# EAGLE board EM80RD (EAGLE 7.4.0), part 1 of 2
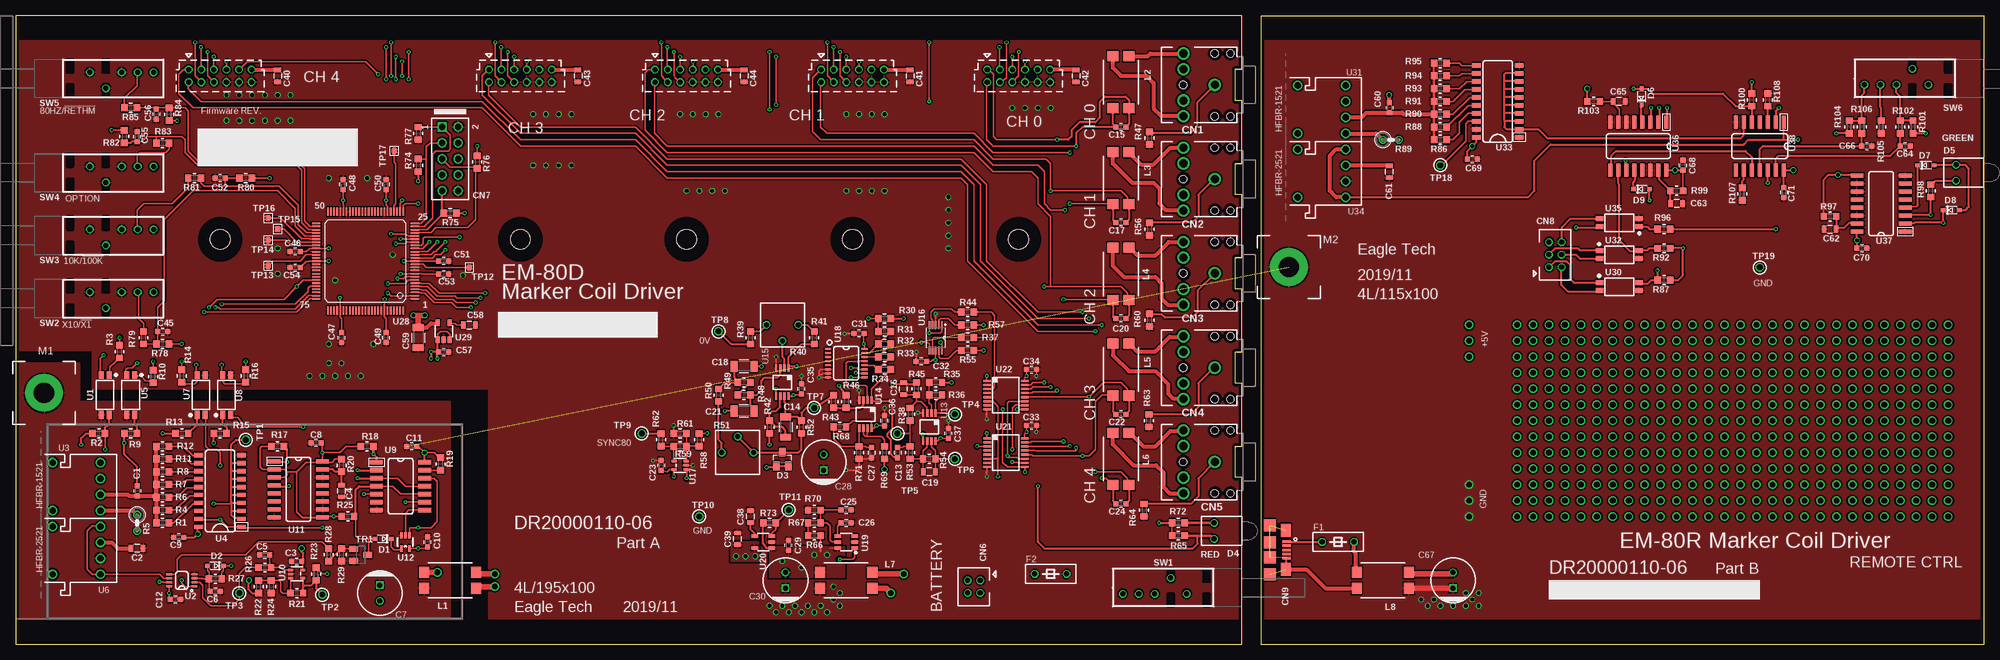
[diagram p6: board, top side]
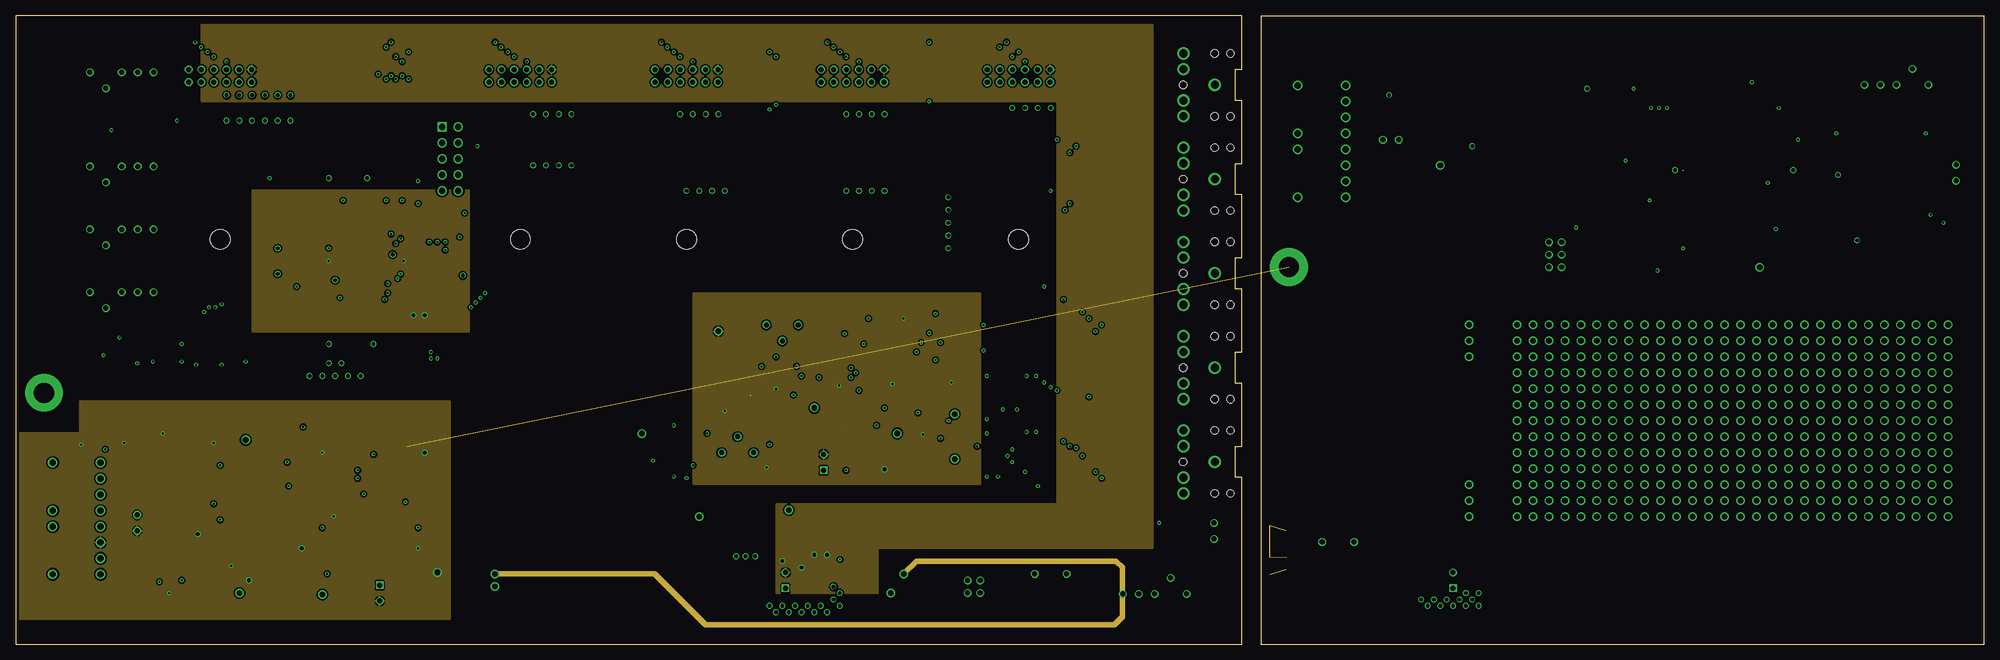
[diagram p7: board, inner layer Route2]
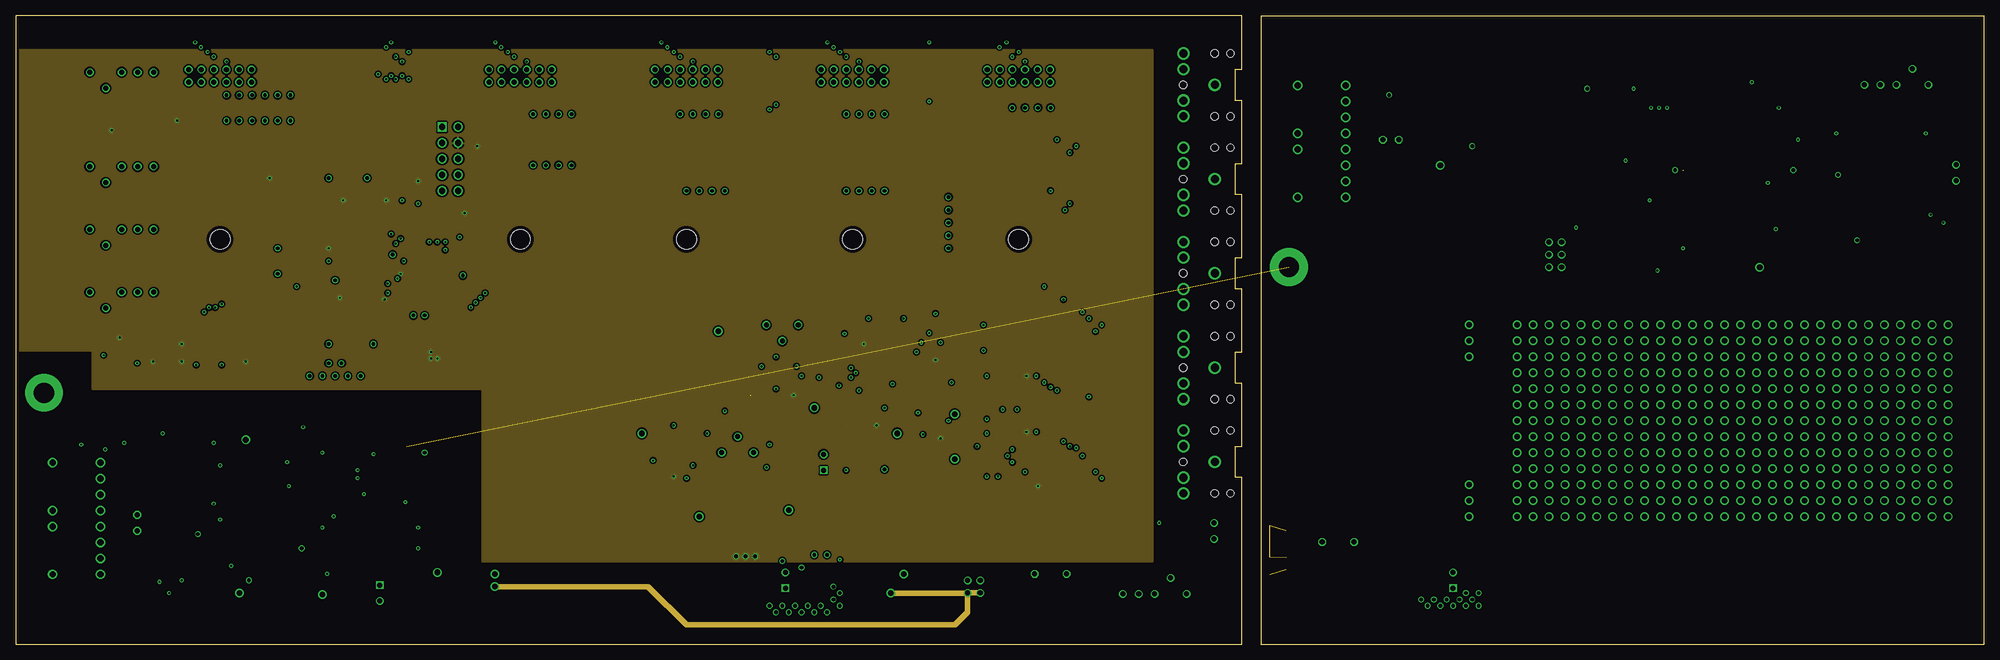
[diagram p8: board, inner layer Route15]
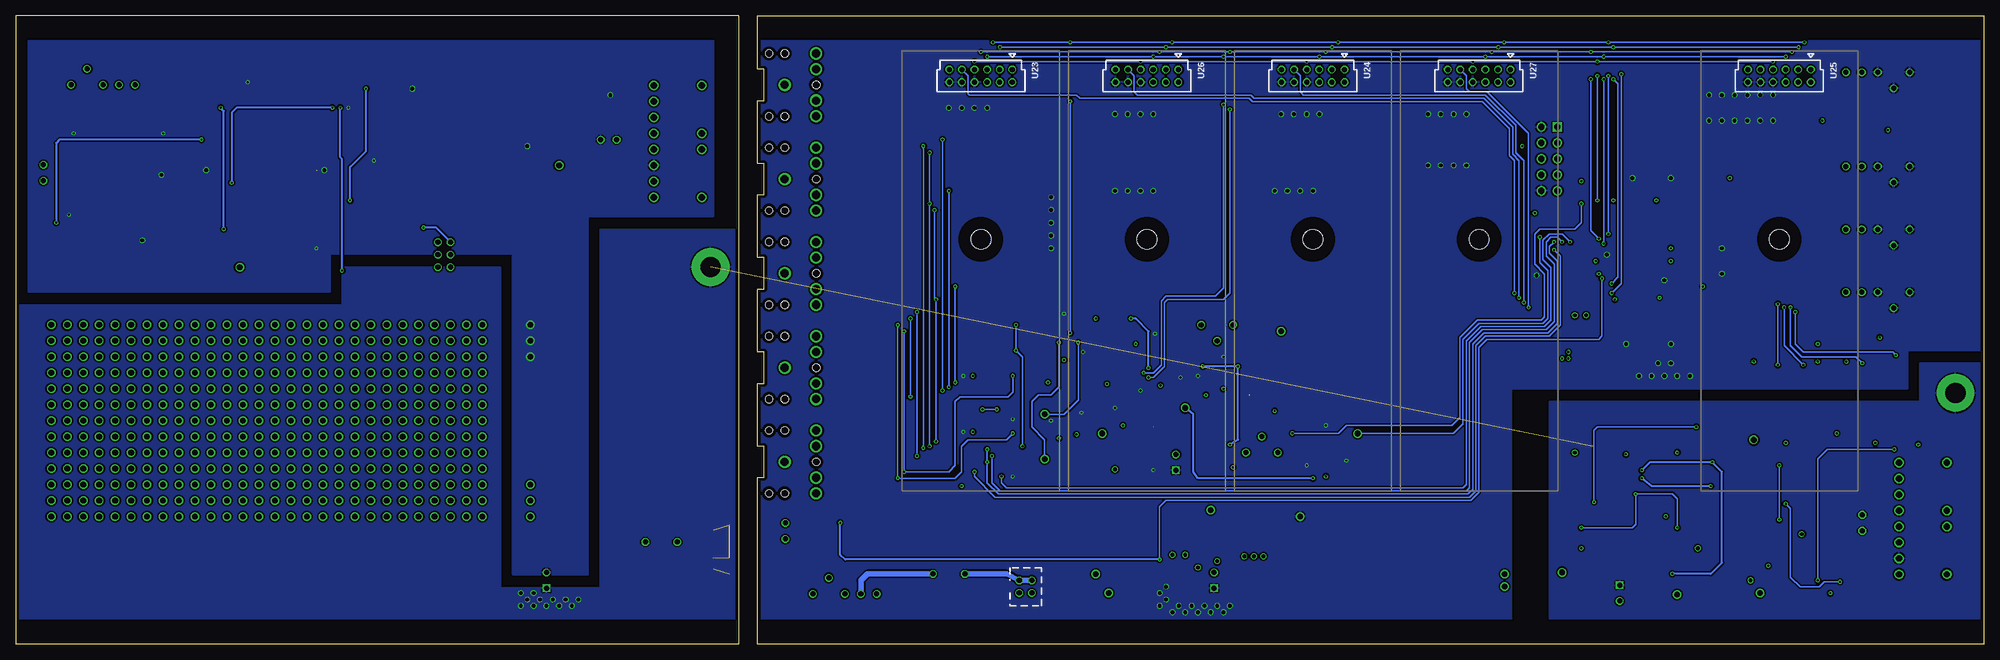
[diagram p9: board, bottom side, seen from below]

Size 313 x 100 mm. Coordinates in mm from the lower left corner, seen from the top.
Outline: 0,0 195,0 195,26.5 194,26.5 194,31.5 195,31.5 195,41.5 194,41.5 194,46.5 195,46.5 195,56.5 194,56.5 194,61.5 195,61.5 195,71.5 194,71.5 194,76.5 195,76.5 195,86.5 194,86.5 194,91.5 195,91.5 195,100 0,100 0,0
Outline: 198,0 313,0 313,100 198,100 198,0
Copper layers (1+2*15+16): Top 0.018mm / dielectric 0.25mm / Route2 0.035mm / dielectric 1mm / Route15 0.035mm / dielectric 0.25mm / Bottom 0.018mm
Design rules "pban_5mil-l4 *": minimum track width 5mil, minimum drill 0.3mm, track to track 5mil, track to pad 0.229mm, pad to pad 5mil, via to via 5mil, smd to smd 5mil, copper to edge 0.5mm, drill to drill 0.5mm, minimum pad ring 0.15mm, minimum via ring 0.15mm, stop-mask expansion 0.05mm, vias tented up to drill 0.35mm, thermal gap 10mil
tRestrict: area 0,0 to 195,3; area 0,97 to 195,100; area 198,0 to 313,3; area 198,97 to 313,100
bRestrict: area 198,97 to 313,100; area 198,0 to 313,3

## Footprints (pad centres in the part's own frame; a part is rotated, then mirrored left to right if it is on the bottom)
CM1608 = smd 0.8 x 0.8: 1 -0.8,0; 2 0.8,0
CM2012 = smd 0.7 x 1.1: 1 -0.95,0; 2 0.95,0
PHI_6.3 = drill 0.8 square: NEG 0,-1.25 | drill 0.8: POS 0,1.25
CM3216 = smd 1.1 x 1.8: 1 -1.6,0; 2 1.6,0
35RAPC2BHN2 = drill 1.3: 1 4.3,0; 2 9.3,-5; 3 9.3,5; 10 9.3,-2.5; 11 9.3,2.5 | hole 1.2: 4.3,5; 9.3,0; 1.8,-5; 4.3,-5; 1.8,5
DF11-4DP-2DSA = drill 0.8: 1 1,-1; 2 1,1; 3 -1,-1; 4 -1,1
PIN_HEADER_10PIN = drill 1 square: 1 -5.08,-1.27 | drill 1: 2 -5.08,1.27; 3 -2.54,-1.27; 4 -2.54,1.27; 5 0,-1.27; 6 0,1.27; 7 2.54,-1.27; 8 2.54,1.27; 9 5.08,-1.27; 10 5.08,1.27
DF11-6DP-2DSA = drill 0.8: 1 2,-1; 2 2,1; 3 0,-1; 4 0,1; 5 -2,-1; 6 -2,1
ZX62-B-5PA = smd 0.4 x 1.35: 1 -1.3,2.675; 2 -0.65,2.675; 3 0,2.675; 4 0.65,2.675; 5 1.3,2.675 | smd 1.9 x 1.9: C1 3.9,0; C2 1.2,0; C3 -1.2,0; C4 -3.9,0 | smd 2.1 x 1.6: C5 3.1,2.55; C6 -3.1,2.55
SOD323-R = smd 0.8 x 0.6: A 1.25,0; C -1.25,0
SOT23 = smd 1 x 1.4: 1 -0.95,-1.1; 2 0.95,-1.1; 3 0,1.1
L-93A8CB = drill 0.8: A 1.27,0; C -1.27,0
8X3/5.08 = drill 0.813 octagon: 1 -2.54,0; 2 2.54,0
ZJYS51-2 = smd 1.8 x 1.6: 1 -1.27,-4.15; 2 1.27,-4.15; 3 1.27,4.15; 4 -1.27,4.15
VAB_3_10_CONTACT = drill 3.2 pad 6: CASE1 0,0
RM1608 = smd 1 x 1.1: 1 -1,0; 2 1,0
0207/2V = drill 0.813 octagon: 1 -1.27,0; 2 1.27,0
CT-6 = drill 0.8: 1 -2.54,0; 2 0,2.54; 3 2.54,0
A-12* = drill 0.8: 1 2.54,1; 2 0,1; 3 -2.54,1; 7 -7.62,1; 8 -5.08,-1.54
TP_TH_0R9MM = drill 0.9: 1 0,0
TP_PAD_1MM = smd 1 x 1: P$1 0,0
SOT23-BEC = smd 1 x 1.4: B -0.95,-1.1; C 0,1.1; E 0.95,-1.1
SO4(11-3C1)(TOSHIBA) = smd 0.8 x 1.2: 1 -0.635,-3.15; 2 0.635,-3.15; 3 0.635,3.15; 4 -0.635,3.15
SSOP8-P-065 = smd 0.34 x 0.9: 1 -0.975,-2; 2 -0.325,-2; 3 0.352,-2; 4 0.975,-2; 5 0.975,2; 6 0.325,2; 7 -0.325,2; 8 -0.975,2
HFBR-X52X = drill 1: 1 0,3.81; 2 0,1.27; 3 0,-1.27; 4 0,-3.81; 5 7.62,-3.81; 8 7.62,3.81
SO20_300MIL = smd 0.7 x 1.4: 1 -5.715,-3.4; 2 -4.445,-3.4; 3 -3.175,-3.4; 4 -1.905,-3.4; 5 -0.635,-3.4; 6 0.635,-3.4; 7 1.905,-3.4; 8 3.175,-3.4; 9 4.445,-3.4; 10 5.715,-3.4; 11 5.715,3.4; 12 4.445,3.4; 13 3.175,3.4; 14 1.905,3.4; 15 0.635,3.4; 16 -0.635,3.4; 17 -1.905,3.4; 18 -3.175,3.4; 19 -4.445,3.4; 20 -5.715,3.4
SO14_300MIL = smd 0.66 x 2.032: 1 -3.81,-3.835; 2 -2.54,-3.835; 3 -1.27,-3.835; 4 0,-3.835; 5 1.27,-3.835; 6 2.54,-3.835; 7 3.81,-3.835; 8 3.81,3.835; 9 2.54,3.835; 10 1.27,3.835; 11 0,3.835; 12 -1.27,3.835; 13 -2.54,3.835; 14 -3.81,3.835
SC88A = smd 0.4 x 0.8: 1 -0.65,-0.95; 2 0,-0.95; 3 0.65,-0.95; 4 0.65,0.95; 5 -0.65,0.95
SO16_300MIL = smd 0.66 x 2.032: 1 -4.445,-3.835; 2 -3.175,-3.835; 3 -1.905,-3.835; 4 -0.635,-3.835; 5 0.635,-3.835; 6 1.905,-3.835; 7 3.175,-3.835; 8 4.445,-3.835; 9 4.445,3.835; 10 3.175,3.835; 11 1.905,3.835; 12 0.635,3.835; 13 -0.635,3.835; 14 -1.905,3.835; 15 -3.175,3.835; 16 -4.445,3.835
SSOP5-P-065A(USV) = smd 0.4 x 1: 1 -0.65,-1.05; 2 0,-1.05; 3 0.65,-1.05; 4 0.65,1.05; 5 -0.62,1.05
MSO8_AEL = smd 0.34 x 1.19: 1 -0.975,-2.23; 2 -0.325,-2.23; 3 0.325,-2.23; 4 0.975,-2.23; 5 0.975,2.23; 6 0.325,2.23; 7 -0.325,2.23; 8 -0.975,2.23
MSOP10 = smd 1.27 x 0.279: 1 -2.032,0.991; 2 -2.032,0.508; 3 -2.032,0; 4 -2.032,-0.508; 5 -2.032,-0.991; 6 2.032,-0.991; 7 2.032,-0.508; 8 2.032,0; 9 2.032,0.508; 10 2.032,0.991
TSSOP16-P-044-065A = smd 0.29 x 1: 1 -2.275,-2.9; 2 -1.625,-2.9; 3 -0.975,-2.9; 4 -0.325,-2.9; 5 0.325,-2.9; 6 0.975,-2.9; 7 1.625,-2.9; 8 2.275,-2.9; 9 2.275,2.9; 10 1.625,2.9; 11 0.975,2.9; 12 0.325,2.9; 13 -0.325,2.9; 14 -0.975,2.9; 15 -1.625,2.9; 16 -2.275,2.9
SOT-23 = smd 0.6 x 1.05: 1 -0.95,-1.35; 2 0,-1.35; 3 0.95,-1.35; 4 0.95,1.35; 5 0,1.35; 6 -0.95,1.35
SOT-23-5 = smd 0.6 x 1.05: 1 -0.95,-1.35; 2 0,-1.35; 3 0.95,-1.35; 4 0.95,1.35; 5 -0.95,1.35
TSSOP16_AEL = smd 0.34 x 1.19: 1 -2.275,-2.97; 2 -1.625,-2.97; 3 -0.975,-2.97; 4 -0.325,-2.97; 5 0.325,-2.97; 6 0.975,-2.97; 7 1.625,-2.97; 8 2.275,-2.97; 9 2.275,2.97; 10 1.625,2.97; 11 0.975,2.97; 12 0.325,2.97; 13 -0.325,2.97; 14 -0.975,2.97; 15 -1.625,2.97; 16 -2.275,2.97
DR20000114 = drill 0.8: 1 1,-5; 2 -1,-5; 3 1,-3; 4 -1,-3; 5 1,-1; 6 -1,-1; 7 1,1; 8 -1,1; 9 1,3; 10 -1,3; 11 1,5; 12 -1,5 | hole 3.2: -26,0
QFP100_0.5 = smd 1.3 x 0.25: 1 -7.85,6; 2 -7.85,5.5; 3 -7.85,5; 4 -7.85,4.5; 5 -7.85,4; 6 -7.85,3.5; 7 -7.85,3; 8 -7.85,2.5; 9 -7.85,2; 10 -7.85,1.5; 11 -7.85,1; 12 -7.85,0.5; 13 -7.85,0; 14 -7.85,-0.5; 15 -7.85,-1; 16 -7.85,-1.5; 17 -7.85,-2; 18 -7.85,-2.5; 19 -7.85,-3; 20 -7.85,-3.5; 21 -7.85,-4; 22 -7.85,-4.5; 23 -7.85,-5; 24 -7.85,-5.5; 25 -7.85,-6; 51 7.85,-6; 52 7.85,-5.5; 53 7.85,-5; 54 7.85,-4.5; 55 7.85,-4; 56 7.85,-3.5; 57 7.85,-3; 58 7.85,-2.5; 59 7.85,-2; 60 7.85,-1.5; 61 7.85,-1; 62 7.85,-0.5; 63 7.85,0; 64 7.85,0.5; 65 7.85,1; 66 7.85,1.5; 67 7.85,2; 68 7.85,2.5; 69 7.85,3; 70 7.85,3.5; 71 7.85,4; 72 7.85,4.5; 73 7.85,5; 74 7.85,5.5; 75 7.85,6 | smd 0.25 x 1.3: 26 -6,-7.85; 27 -5.5,-7.85; 28 -5,-7.85; 29 -4.5,-7.85; 30 -4,-7.85; 31 -3.5,-7.85; 32 -3,-7.85; 33 -2.5,-7.85; 34 -2,-7.85; 35 -1.5,-7.85; 36 -1,-7.85; 37 -0.5,-7.85; 38 0,-7.85; 39 0.5,-7.85; 40 1,-7.85; 41 1.5,-7.85; 42 2,-7.85; 43 2.5,-7.85; 44 3,-7.85; 45 3.5,-7.85; 46 4,-7.85; 47 4.5,-7.85; 48 5,-7.85; 49 5.5,-7.85; 50 6,-7.85; 76 6,7.85; 77 5.5,7.85; 78 5,7.85; 79 4.5,7.85; 80 4,7.85; 81 3.5,7.85; 82 3,7.85; 83 2.5,7.85; 84 2,7.85; 85 1.5,7.85; 86 1,7.85; 87 0.5,7.85; 88 0,7.85; 89 -0.5,7.85; 90 -1,7.85; 91 -1.5,7.85; 92 -2,7.85; 93 -2.5,7.85; 94 -3,7.85; 95 -3.5,7.85; 96 -4,7.85; 97 -4.5,7.85; 98 -5,7.85; 99 -5.5,7.85; 100 -6,7.85

## Placement (x,y rotation side)
C1  680p  [CM1608]  19.3,24.38 270 top
C2  1u/25V  [CM2012]  19.3,15.24 180 top
C3  0.1u/16V  [CM1608]  44.7,13.21 0 top
C4  1u/16V  [CM2012]  51.82,24.38 90 top
C5  0.1u/16V  [CM1608]  39.62,14.22 0 top
C6  1u/25V  [CM1608]  31.75,8.38 0 top
C7  56u/10V/OS  [PHI_6.3]  57.91,8.13 180 top
C8  0.1u/16V  [CM1608]  47.75,32 180 top
C9  0.1u/16V  [CM1608]  25.91,17.02 180 top
C10  0.1u/16V  [CM1608]  65.53,16.26 90 top
C11  0.1u/16V  [CM1608]  62.99,31.5 180 top
C12  0.1u/16V  [CM1608]  25.4,7.11 0 top
C13  1u/25V  [CM1608]  140.21,30.48 270 top
C14  22n  [CM3216]  122.43,34.54 270 top
C15  10p  [CM1608]  175.77,82.3 180 top
C16  3.3n  [CM2012]  141.22,40.64 90 top
C17  10p  [CM1608]  175.77,67.06 180 top
C18  22n  [CM3216]  115.82,44.2 180 top
C19  3.3n  [CM2012]  145.29,27.43 180 top
C20  10p  [CM1608]  175.77,51.82 180 top
C21  22n  [CM3216]  115.82,37.08 180 top
C22  10p  [CM1608]  175.77,36.58 180 top
C23  0.1u/16V  [CM1608]  102.62,28.45 270 top
C24  10p  [CM1608]  175.77,22.35 180 top
C25  0.1u/16V  [CM1608]  132.08,21.34 0 top
C26  0.1u/16V  [CM1608]  132.08,19.3 0 top
C27  1u/25V  [CM1608]  136.14,30.48 270 top
C28  56u/10V/OS  [PHI_6.3]  128.49,28.94 0 top
C29  0.1u/16V  [CM1608]  122.94,15.75 90 top
C30  56u/10V/OS  [PHI_6.3]  122.43,10.16 0 top
C31  0.1u/16V  [CM1608]  134.11,49.4 180 top
C32  0.1u/16V  [CM1608]  144.02,44.96 180 top
C33  0.1u/16V  [CM1608]  161.54,34.8 0 top
C34  0.1u/16V  [CM1608]  161.54,43.69 0 top
C35  0.1u/16V  [CM1608]  124.97,40.64 90 top
C36  0.1u/16V  [CM1608]  138.18,35.56 90 top
C37  0.1u/16V  [CM1608]  148.34,33.53 90 top
C38  10n  [CM2012]  116.84,20.32 90 top
C39  4.7u/25V  [CM2012]  114.81,16.76 90 top
C40  4.7u/25V  [CM2012]  41.66,90.42 270 top
C41  4.7u/25V  [CM2012]  142.24,90.42 270 top
C42  4.7u/25V  [CM2012]  168.66,90.42 270 top
C43  4.7u/25V  [CM2012]  89.41,90.42 270 top
C44  4.7u/25V  [CM2012]  115.82,90.42 270 top
C45  0.1u/16V  [CM1608]  23.37,49.78 0 top
C46  0.1u/16V  [CM1608]  44.45,62.48 180 top
C47  0.1u/16V  [CM1608]  51.82,48.77 90 top
C48  0.1u/16V  [CM1608]  52.07,73.15 90 top
C49  0.1u/16V  [CM1608]  58.93,48.77 90 top
C50  0.1u/16V  [CM1608]  58.93,73.15 90 top
C51  0.1u/16V  [CM1608]  68.07,60.96 180 top
C52  0.1u/16V  [CM1608]  32.51,74.17 180 top
C53  0.1u/16V  [CM1608]  68.07,58.93 0 top
C54  0.1u/16V  [CM1608]  44.45,59.94 0 top
C55  0.1u/16V  [CM1608]  19.3,80.77 90 top
C56  0.1u/16V  [CM1608]  22.35,84.33 270 top
C57  0.1u/16V  [CM1608]  68.07,46.48 0 top
C58  10n  [CM2012]  72.14,50.8 0 top
C59  10u/25V  [CM3216]  64.01,48.77 270 top
C60  680p  [CM1608]  218.44,85.34 270 top
C61  1u/25V  [CM2012]  218.44,75.18 90 top
C62  4.7u/25V  [CM2012]  288.54,66.04 0 top
C63  0.1u/16V  [CM2012]  264.16,70.1 180 top
C64  0.1u/16V  [CM1608]  300.48,79.25 0 top
C65  0.1u/16V  [CM2012]  255.02,86.36 180 top
C66  0.1u/16V  [CM1608]  294.39,79.25 0 top
C67  56u/10V/OS  [PHI_6.3]  228.6,10.16 0 top
C68  0.1u/16V  [CM1608]  265.18,76.2 90 top
C69  0.1u/16V  [CM1608]  231.65,77.22 0 top
C70  0.1u/16V  [CM1608]  293.62,62.99 0 top
C71  0.1u/16V  [CM1608]  281.18,71.88 270 top
CN1  SJ1-3523N  [35RAPC2BHN2]  195,89 180 top
CN2  SJ1-3523N  [35RAPC2BHN2]  195,74 180 top
CN3  SJ1-3523N  [35RAPC2BHN2]  195,59 180 top
CN4  SJ1-3523N  [35RAPC2BHN2]  195,44 180 top
CN5  SJ1-3523N  [35RAPC2BHN2]  195,29 180 top
CN6  DF11-4DP-2DSA  [DF11-4DP-2DSA]  152.4,9.14 90 top
CN7  XJ8C-1011  [PIN_HEADER_10PIN]  69.09,77.22 270 top
CN8  DF11-6DP-2DSA  [DF11-6DP-2DSA]  244.86,61.98 270 top
CN9  ZX62-B-5PA  [ZX62-B-5PA]  199.45,15 270 top
D1  1SS357  [SOD323-R]  58.42,16.76 180 top
D2  1SS357  [SOD323-R]  31.75,12.45 180 top
D3  1SS226  [SOT23]  121.92,29.46 0 top
D4  L-93A8CB/1ID  [L-93A8CB]  190.6,18 270 top
D5  L-93A8CB/1GD  [L-93A8CB]  308.6,75 270 top
D6  1SS357  [SOD323-R]  258.57,87.12 90 top
D7  1SS357  [SOD323-R]  303.78,76.2 0 top
D8  1SS357  [SOD323-R]  307.85,69.09 0 top
D9  1SS357  [SOD323-R]  258.57,72.39 0 top
F1  RXEF050  [8X3/5.08]  210.31,16.26 0 top
F2  RXEF050  [8X3/5.08]  164.59,11.18 0 top
L1  ZJYS51R5-2PBT-01  [ZJYS51-2]  69.09,10.16 270 top
L2  ZJYS51R5-2PBT-01  [ZJYS51-2]  175.77,89.41 180 top
L3  ZJYS51R5-2PBT-01  [ZJYS51-2]  175.77,74.17 180 top
L4  ZJYS51R5-2PBT-01  [ZJYS51-2]  175.77,58.93 180 top
L5  ZJYS51R5-2PBT-01  [ZJYS51-2]  175.77,43.69 180 top
L6  ZJYS51R5-2PBT-01  [ZJYS51-2]  175.77,29.46 180 top
L7  ZJYS51R5-2PBT-01  [ZJYS51-2]  132.08,10.16 270 top
L8  ZJYS51R5-2PBT-01  [ZJYS51-2]  217.42,10.16 90 top
M1  VAB-3-10  [VAB_3_10_CONTACT]  4.5,40 0 top
M2  VAB-3-10  [VAB_3_10_CONTACT]  202.5,60 0 top
R1  68/THICK  [RM1608]  23.37,19.3 0 top
R2  8.2k/THICK  [RM1608]  13.21,33.53 0 top
R3  2k/THICK  [RM1608]  16.5,46.55 90 top
R4  68/THICK  [RM1608]  23.37,21.34 0 top
R5  430/LEAD  [0207/2V]  19.32,19.3 270 top
R6  68/THICK  [RM1608]  23.37,23.37 0 top
R7  68/THICK  [RM1608]  23.37,25.4 0 top
R8  68/THICK  [RM1608]  23.37,27.43 0 top
R9  8.2k/THICK  [RM1608]  18.29,33.53 0 top
R10  2k/THICK  [RM1608]  21.84,42.58 90 top
R11  68/THICK  [RM1608]  23.37,29.46 0 top
R12  68/THICK  [RM1608]  23.37,31.5 0 top
R13  3.3k/THICK  [RM1608]  26.42,33.53 0 top
R14  2.7k/THICK  [RM1608]  26.42,42.67 90 top
R15  3.3k/THICK  [RM1608]  32.51,33.53 0 top
R16  2.7k/THICK  [RM1608]  36.58,42.67 90 top
R17  100k/THICK  [RM1608]  41.66,31.5 0 top
R18  100k/THICK  [RM1608]  55.88,31.5 180 top
R19  100k/THICK  [RM1608]  67.56,28.68 90 top
R20  51k  [RM1608]  51.82,28.45 270 top
R21  100k  [RM1608]  44.7,8.13 0 top
R22  51k  [RM1608]  38.61,9.14 270 top
R23  1k/THICK  [RM1608]  47.75,11.18 90 top
R24  100k  [RM1608]  40.64,9.14 90 top
R25  100k/THICK  [RM1608]  52.83,20.32 0 top
R26  51k/THICK  [RM1608]  39.62,12.19 180 top
R27  1M/THICK  [RM1608]  31.75,10.41 0 top
R28  10k/THICK  [RM1608]  49.78,14.22 270 top
R29  10k/THICK  [RM1608]  51.82,14.22 90 top
R30  51k  [RM1608]  138.18,51.82 180 top
R31  51k  [RM1608]  138.18,49.78 0 top
R32  0  [RM1608]  138.18,47.75 0 top
R33  0  [RM1608]  138.18,45.72 0 top
R34  0  [RM1608]  138.18,43.69 0 top
R35  51k  [RM1608]  146.3,41.66 180 top
R36  51k  [RM1608]  146.3,39.62 0 top
R37  100k  [RM1608]  151.38,48.77 0 top
R38  51k  [RM1608]  142.24,36.58 90 top
R39  100k  [RM1608]  116.84,48.77 90 top
R40  20k/POT  [CT-6]  121.92,50.8 180 top
R41  100k  [RM1608]  127,48.77 270 top
R42  91k  [RM1608]  119.89,34.54 90 top
R43  24k  [RM1608]  130.05,38.61 270 top
R44  10k  [RM1608]  151.38,52.83 0 top
R45  51k  [RM1608]  143.26,40.64 270 top
R46  24k  [RM1608]  132.08,38.61 270 top
R47  0  [RM1608]  180.34,80.52 90 top
R48  82k  [RM1608]  115.82,39.62 180 top
R49  7.5k  [RM1608]  115.82,41.66 180 top
R50  75k  [RM1608]  111.76,39.62 270 top
R51  20k/POT  [CT-6]  114.81,30.48 0 top
R52  9.1k  [RM1608]  124.97,34.54 90 top
R53  51k  [RM1608]  142.24,30.48 270 top
R54  51k  [RM1608]  145.29,29.46 0 top
R55  100k  [RM1608]  151.38,46.74 0 top
R56  0  [RM1608]  180.34,66.04 90 top
R57  10k  [RM1608]  151.38,50.8 0 top
R58  51k  [RM1608]  108.71,32.51 90 top
R59  1M/THICK  [RM1608]  105.66,31.5 180 top
R60  0  [RM1608]  180.34,51.56 90 top
R61  51k  [RM1608]  105.66,33.53 0 top
R62  47/THICK  [RM1608]  102.62,32.51 90 top
R63  0  [RM1608]  180.21,35.56 90 top
R64  0  [RM1608]  179.45,21.34 90 top
R65  100k/THICK  [RM1608]  184.91,17.27 0 top
R66  9.1k  [RM1608]  127,17.27 0 top
R67  110k  [RM1608]  127,19.3 180 top
R68  68k  [RM1608]  131.06,34.54 0 top
R69  30/THICK  [RM1608]  138.18,30.48 270 top
R70  11k  [RM1608]  127,21.34 0 top
R71  68k  [RM1608]  134.11,30.48 90 top
R72  1.6k/THICK  [RM1608]  184.91,19.3 0 top
R73  100k/THICK  [RM1608]  119.89,19.3 0 top
R74  ---  [RM1608]  64.01,76.2 270 top
R75  10k/THICK  [RM1608]  69.09,68.58 0 top
R76  10k/THICK  [RM1608]  73.41,76.71 90 top
R77  1k/THICK  [RM1608]  64.01,81.28 90 top
R78  100k/THICK  [RM1608]  23.37,47.75 0 top
R79  10k/THICK  [RM1608]  20.32,48.77 90 top
R80  100k/THICK  [RM1608]  36.58,74.17 0 top
R81  10k/THICK  [RM1608]  28.45,74.17 180 top
R82  100k/THICK  [RM1608]  17.27,80.77 90 top
R83  10k/THICK  [RM1608]  23.37,79.76 0 top
R84  100k/THICK  [RM1608]  24.38,84.33 270 top
R85  10k/THICK  [RM1608]  18.29,85.34 180 top
R86  68/THICK  [RM1608]  226.57,80.26 0 top
R87  8.2k/THICK  [RM1608]  262.13,57.91 180 top
R88  68/THICK  [RM1608]  226.57,82.3 0 top
R89  430/LEAD  [0207/2V]  218.69,80.26 0 top
R90  68/THICK  [RM1608]  226.57,84.33 0 top
R91  68/THICK  [RM1608]  226.57,86.36 0 top
R92  8.2k/THICK  [RM1608]  262.13,62.99 180 top
R93  68/THICK  [RM1608]  226.57,88.39 0 top
R94  68/THICK  [RM1608]  226.57,90.42 0 top
R95  68/THICK  [RM1608]  226.57,92.46 0 top
R96  1k/THICK  [RM1608]  262.13,66.04 0 top
R97  330k  [RM1608]  288.54,68.07 0 top
R98  300/THICK  [RM1608]  304.55,72.14 270 top
R99  750k  [RM1608]  264.16,72.14 180 top
R100  2.2k/THICK  [RM1608]  276.1,86.61 90 top
R101  100k/THICK  [RM1608]  301.75,82.3 270 top
R102  100k/THICK  [RM1608]  299.72,82.3 270 top
R103  240k  [RM1608]  250.95,86.36 0 top
R104  100k/THICK  [RM1608]  291.59,82.3 270 top
R105  1k/THICK  [RM1608]  296.67,82.3 90 top
R106  100k/THICK  [RM1608]  293.62,82.3 270 top
R107  100k/THICK  [RM1608]  274.57,71.63 90 top
R108  100k/THICK  [RM1608]  278.64,86.61 270 top
SW1  A-12AV  [A-12*]  178.6,9 180 top
SW2  A-12AV  [A-12*]  19.4,55 0 top
SW3  A-12AV  [A-12*]  19.4,65 0 top
SW4  ---  [A-12*]  19.4,75 0 top
SW5  ---  [A-12*]  19.4,90 0 top
SW6  A-18AV  [A-12*]  296.56,90 180 top
TP1  TP-LC3G  [TP_TH_0R9MM]  36.58,32.51 0 top
TP2  TP-LC3G  [TP_TH_0R9MM]  48.77,7.87 0 top
TP3  TP-LC3G  [TP_TH_0R9MM]  35.56,8.13 0 top
TP4  TP-LC3G  [TP_TH_0R9MM]  149.35,36.58 0 top
TP5  TP-LC3G  [TP_TH_0R9MM]  140.21,33.53 0 top
TP6  TP-LC3G  [TP_TH_0R9MM]  149.35,29.46 0 top
TP7  TP-LC3G  [TP_TH_0R9MM]  127,37.59 0 top
TP8  TP-LC3G  [TP_TH_0R9MM]  111.76,49.78 0 top
TP9  TP-LC3G  [TP_TH_0R9MM]  99.57,33.53 0 top
TP10  TP-LC3G  [TP_TH_0R9MM]  108.71,20.32 0 top
TP11  TP-LC3G  [TP_TH_0R9MM]  122.94,21.34 90 top
TP12  TP-1PAD  [TP_PAD_1MM]  72.14,59.94 0 top
TP13  TP-1PAD  [TP_PAD_1MM]  40.13,60.2 0 top
TP14  TP-1PAD  [TP_PAD_1MM]  40.13,64.26 0 top
TP15  TP-1PAD  [TP_PAD_1MM]  41.66,66.04 0 top
TP16  TP-1PAD  [TP_PAD_1MM]  40.13,67.82 0 top
TP17  TP-1PAD  [TP_PAD_1MM]  60.2,78.49 270 top
TP18  TP-LC3G  [TP_TH_0R9MM]  226.57,76.2 0 top
TP19  TP-LC3G  [TP_TH_0R9MM]  277.37,59.94 0 top
TR1  2SC2712GR  [SOT23-BEC]  54.86,14.22 270 top
U1  TLP291GR  [SO4(11-3C1)(TOSHIBA)]  14.22,39.62 180 top
U2  TC7W14FU  [SSOP8-P-065]  26.42,10.16 90 top
U3  HFBR-1521Z  [HFBR-X52X]  13.5,25.08 180 top
U4  74HC540AF  [SO20_300MIL]  32.51,24.38 90 top
U5  TLP291GR  [SO4(11-3C1)(TOSHIBA)]  18.29,39.62 180 top
U6  HFBR-2521Z  [HFBR-X52X]  13.5,14.92 180 top
U7  TLP291GR  [SO4(11-3C1)(TOSHIBA)]  29.46,39.62 0 top
U8  TLP291GR  [SO4(11-3C1)(TOSHIBA)]  33.53,39.62 0 top
U9  74HC74AF  [SO14_300MIL]  61.21,25.15 270 top
U10  NJU7108F3  [SC88A]  44.7,11.18 270 top
U11  74HC123AF  [SO16_300MIL]  44.96,24.64 270 top
U12  TC7S00FU  [SSOP5-P-065A(USV)]  61.98,16.26 180 top
U13  OPA2344EA  [MSO8_AEL]  145.29,34.54 180 top
U14  OPA2344EA  [MSO8_AEL]  135.13,36.58 180 top
U15  OPA2344EA  [MSO8_AEL]  121.92,41.66 180 top
U16  TS5A23159DGS  [MSOP10]  146.3,48.77 270 top
U17  NJU7108F3  [SC88A]  105.66,28.45 90 top
U18  74VHC4052AFT  [TSSOP16-P-044-065A]  132.08,44.7 270 top
U19  TPS3808G01DBV  [SOT-23]  132.08,16.26 90 top
U20  TPS79933DDC  [SOT-23-5]  118.87,16.26 90 top
U21  MAX4617CUE+  [TSSOP16_AEL]  157.48,30.48 270 top
U22  MAX4617CUE+  [TSSOP16_AEL]  157.48,39.62 270 top
U23  DR20000114  [DR20000114]  159.51,90.42 90 bottom
U24  DR20000114  [DR20000114]  106.68,90.42 90 bottom
U25  DR20000114  [DR20000114]  32.51,90.42 90 bottom
U26  DR20000114  [DR20000114]  133.1,90.42 90 bottom
U27  DR20000114  [DR20000114]  80.26,90.42 90 bottom
U28  5M80ZT100  [QFP100_0.5]  55.63,60.96 180 top
U29  TPS79918DDC  [SOT-23-5]  68.07,49.78 0 top
U30  TLP291GR  [SO4(11-3C1)(TOSHIBA)]  255.02,56.9 270 top
U31  HFBR-1521Z  [HFBR-X52X]  211.5,85.08 180 top
U32  TLP291GR  [SO4(11-3C1)(TOSHIBA)]  255.02,61.98 270 top
U33  74HC540AF  [SO20_300MIL]  235.71,86.36 90 top
U34  HFBR-2521Z  [HFBR-X52X]  211.5,74.92 180 top
U35  TLP291GR  [SO4(11-3C1)(TOSHIBA)]  255.02,67.06 90 top
U36  74HC123AF  [SO16_300MIL]  258.06,79.25 180 top
U37  74HC123AF  [SO16_300MIL]  296.67,70.1 90 top
U38  74HC14AF  [SO14_300MIL]  277.37,79.25 180 top

## Tracks (layer width: path | path; a pad name or v marks a point on that pad's centre or on a via)
0+  (via drill 0.3)
  Top 0.203: 154.43,91.44 154.69,91.44 155.5,90.68 155.5,80.77 155.96,80.26 v165.61,80.26
  Top 0.254: U22.13 161.62,39.95 161.8,40.13 165.61,40.13 v165.61,40.39
  Top 0.305: C15.1 177.04,82.77 L2.4 177.04,86.61 176.53,87.12 173.23,87.12 172.47,86.36 172.47,83.82 171.7,83.06 169.16,83.06 167.89,81.79 167.89,80.77 167.39,80.26 v165.61,80.26 | U23.1 154.45,91.42 154.43,91.44
  Bottom 0.254: v165.61,80.26 v165.61,40.39
0-  (via drill 0.3)
  Top 0.203: U23.2 154.51,89.23 154.43,89.15 154.43,80.26 155.45,79.25 v168.66,79.25
  Top 0.254: U21.13 162.12,30.8 162.31,30.73 168.66,30.73 v168.66,31.24
  Top 0.305: 174.31,85.45 L2.3 174.5,82.77 C15.2 169.67,82.3 168.66,81.28 v168.66,79.25
  Bottom 0.254: v168.66,79.25 v168.66,31.24
0V  (via drill 0.3, 0.6)
  Top 0.305: D3.2 D3.1 120.9,28.19 120.85,28.14 v119.39,28.14 | U13.5 144.31,33.35 v144.27,33.39 | C21.2 v112.78,37.08 | U15.5 v120.9,40.64 | R46.1 v130.95,41.14 | R30.1 v141.22,51.82 | R35.1 v148.84,41.66 | R45.1 143,41.4 141.48,41.4 C16.2 140.9,41.59 140.72,41.4 v139.45,41.4 | v138.18,27.8 R69.2 | R39.1 113.78,47.77 TP8.1
  pour Route2 (isolate 0.254): 107.7,55.88 153.42,55.88 153.42,25.4 107.7,25.4
1+  (via drill 0.3)
  Top 0.203: U26.1 128.03,91.42 128.02,91.44 126.75,90.17 126.75,81.53 128.02,80.26 152.4,80.26 155.45,77.22 163.83,77.22 164.59,76.45 v164.59,72.14
  Top 0.254: U22.14 161.5,40.6 161.8,40.89 v164.59,40.89 | L3.4 176.87,70.02 176.78,70.1 176.78,71.12 175.77,72.14 v164.59,72.14
  Top 0.305: L3.4 177.04,67.53 C17.1
  Bottom 0.254: v164.59,40.89 v164.59,72.14
1-  (via drill 0.3)
  Top 0.203: U26.2 128.03,89.42 128.02,89.41 128.02,82.3 129.03,81.28 152.4,81.28 155.45,78.23 v167.64,78.23
  Top 0.254: U21.14 161.76,31.45 161.8,31.5 v167.64,31.5 | v167.64,70.1 174.41,70.1 L3.3
  Top 0.305: L3.3 174.5,67.53 C17.2
  Bottom 0.203: v167.64,70.1 v167.64,78.23
  Bottom 0.254: v167.64,31.5 v167.64,70.1
2+  (via drill 0.3)
  Top 0.203: U24.1 101.62,91.42 101.6,91.44 100.58,91.44 100.08,90.93 100.08,81.79 103.63,78.23 152.4,78.23 155.45,75.18 161.54,75.18 162.56,74.17 162.56,70.1 164.59,68.07 164.59,56.9
  Top 0.254: U22.15 161.39,41.25 161.8,41.66 v163.58,41.66 | 177.04,54.86 176.78,54.86 176.78,55.88 175.77,56.9 164.59,56.9 v163.58,56.9
  Top 0.305: C20.1 177.04,52.29 L4.4 177.04,54.86
  Bottom 0.254: v163.58,56.9 v163.58,41.66
2-  (via drill 0.3)
  Top 0.203: U24.2 101.68,89.23 101.6,89.15 101.6,81.28 103.63,79.25 152.4,79.25 155.45,76.2 162.56,76.2 163.58,75.18 163.58,70.1 164.59,69.09 v166.88,69.09
  Top 0.254: U21.15 161.39,32.1 161.54,32.26 v166.62,32.26 | v166.62,54.86 174.41,54.86 L4.3
  Top 0.305: C20.2 174.75,51.82 174.5,52.07 L4.3 174.5,54.86 174.58,54.95
  Bottom 0.203: v166.88,69.09 166.88,55.12 v166.62,54.86
  Bottom 0.254: v166.62,54.86 v166.62,32.26
3+  (via drill 0.3)
  Top 0.203: U27.1 75.2,91.42 75.18,91.44 74.17,90.42 74.17,87.38 80.26,81.28 98.55,81.28 103.63,76.2 150.37,76.2 153.42,73.15 153.42,60.96 162.56,51.82 v170.69,51.82
  Top 0.254: U22.12 162.12,39.3 162.31,39.37 v170.69,39.37 172.97,41.66 175.77,41.66 176.78,40.64 176.78,39.62 176.87,39.54 L5.4
  Top 0.305: L5.4 177.04,37.05 C22.1
  Bottom 0.203: v170.69,51.82 v170.69,39.37
3-  (via drill 0.3)
  Top 0.203: U27.2 75.2,89.42 75.18,89.41 75.18,87.38 80.26,82.3 98.55,82.3 103.63,77.22 150.37,77.22 154.43,73.15 154.43,60.96 162.56,52.83 v169.67,52.83
  Top 0.254: U21.12 161.62,30.16 161.8,29.97 v169.67,29.97 170.69,29.97 171.7,30.99 171.7,38.61 172.72,39.62 173.99,39.62 174.08,39.54 L5.3
  Top 0.305: L5.3 174.5,37.05 C22.2
  Bottom 0.254: v169.67,52.83 v169.67,29.97
4+  (via drill 0.3)
  Top 0.203: U25.1 27.45,91.42 27.43,91.44 26.67,91.44 25.91,90.68 25.91,87.63 28.19,85.34 74.17,85.34 80.26,79.25 98.55,79.25 103.63,74.17 150.37,74.17 151.38,73.15 151.38,60.96 162.56,49.78 v171.7,49.78
  Top 0.254: L6.4 176.87,25.31 176.78,25.4 176.78,26.42 175.77,27.43 v171.7,27.43 | U22.1 154.44,41.9 154.43,41.91 v154.43,42.67
  Top 0.305: L6.4 177.04,22.82 C24.1
  Bottom 0.203: v171.7,49.78 v171.7,27.43
  Bottom 0.254: v154.43,42.67 154.43,40.13 155.19,39.37 162.81,39.37 163.58,38.61 163.58,28.45 164.59,27.43 v171.7,27.43
4-  (via drill 0.3)
  Top 0.203: U25.2 27.45,89.42 27.43,89.41 27.43,88.39 29.46,86.36 74.17,86.36 80.26,80.26 98.55,80.26 103.63,75.18 150.37,75.18 152.4,73.15 152.4,60.96 162.56,50.8 v172.72,50.8
  Top 0.254: v172.72,26.42 173.4,26.42 L6.3
  Top 0.305: L6.3 174.5,22.82 C24.2 | U21.1 154.43,32.77 v154.43,33.53
  Bottom 0.203: 155.45,32.51 v154.43,33.53 | v172.72,50.8 v172.72,26.42
  Bottom 0.254: 155.45,32.51 161.54,32.51 162.56,31.5 162.56,27.43 163.58,26.42 v172.72,26.42
80_POWER
  Top 0.305: U20.3 120.22,17.61 120.9,18.29 120.9,19.29 R73.2 121.92,20.34 TP11.1
!80_OE  (via drill 0.3)
  Top 0.203: v65.79,64.01 64.74,62.96 U28.17
  Top 0.254: U22.6 155.41,38.65 156.21,37.85 156.21,29.46
  Top 0.305: 156.17,29.5 U21.6 | 156.21,29.46 156.17,29.5 | v156.21,26.67 156.21,29.46 | 156.17,29.5 156.17,29.42 156.21,29.46
  Bottom 0.203: v65.79,64.01 67.06,65.28 69.09,65.28 70.1,64.26 70.1,61.21 68.83,59.94 68.83,51.56 69.85,50.55 80.01,50.55 82.3,48.26 82.3,25.4 82.8,24.89 155.45,24.89 156.21,25.65 v156.21,26.67
!LOW_BAT  (via drill 0.3)
  Top 0.203: v60.71,58.17 61.72,58.17 62.02,58.46 U28.8 | R72.1 R65.1
  Top 0.254: U19.1 133.43,13.8 133.1,13.46 v131.06,13.46
  Top 0.305: v181.86,19.3 R72.1
  Bottom 0.203: v60.71,58.17 60.71,49.02 61.21,48.51 78.99,48.51 80.26,47.24 80.26,24.13 81.53,22.86 130.05,22.86 131.06,21.84 v131.06,13.46
  Bottom 0.305: v131.06,13.46 181.1,13.46 181.86,14.22 v181.86,19.3
!OFF
  Top 0.305: U36.10 254.89,73.28 255.02,73.15 255.02,64.26 256.79,62.48 258.04,62.48 U32.4 258.29,62.74 259.59,62.74 259.84,62.99 R92.2
!ON  (via drill 0.3)
  Top 0.305: U30.4 258.29,57.4 259.59,57.4 260.1,57.91 R87.2 261.13,59.2 v261.11,59.44 | U36.2 261.24,82.68 261.11,82.55 261.37,83.82 v261.37,85.34
  Bottom 0.305: v261.11,59.44 261.11,77.22 261.37,77.47 v261.37,85.34
!POWER_80  (via drill 0.3)
  Top 0.203: v55.37,23.88 U9.5 | v32.51,28.45 32.51,30.48 32,30.99 30.73,30.99 30.23,31.5 30.23,36.35 U7.2 | U9.12 66.55,26.42 67.06,25.91 67.06,19.56 66.04,18.54 v64.01,18.54 62.74,18.54 62.63,18.43 U12.1
  Top 0.254: U4.19 29.24,19.81 v32.51,19.81 33.66,18.67 U4.1 36.04,18.54 v48.77,18.54
  Bottom 0.203: v32.51,19.81 v32.51,28.45 | v64.01,18.54 55.88,18.54 55.37,19.05 v55.37,23.88
  Bottom 0.254: v48.77,18.54 48.77,23.11 49.53,23.88 v55.37,23.88
!POWER_ON  (via drill 0.3)
  Top 0.203: R14.1 26.69,41.4 28.45,41.4 28.83,41.78 U7.4 28.7,42.9 v28.7,44.45 | U28.74 46.57,55.46 44.45,53.34 32.51,53.34 32.26,53.59 v31.75,53.59
  Bottom 0.203: v28.7,44.45 31.75,47.5 v31.75,53.59
!POWER_RETHM  (via drill 0.3)
  Top 0.203: U8.2 34.04,36.35 34.29,36.07 35.31,36.07 35.81,35.56 35.81,34.8 36.07,34.54 44.7,34.54 v45.72,34.54 | v61.98,22.61 U9.9
  Bottom 0.203: v61.98,22.61 61.98,34.04 61.47,34.54 v45.72,34.54
!RETHM_OE  (via drill 0.3)
  Top 0.203: U28.7 62.44,57.96 61.98,57.4 v59.18,57.4 | U24.3 103.65,91.42 103.63,91.44 v103.63,95 | U23.3 156.48,91.42 156.46,91.44 v156.46,95 | U26.3 130.05,91.44 v130.05,95 | U27.3 77.22,91.44 v77.22,95 | U25.3 29.46,91.44 v29.46,95 | v58.93,89.92 v58.93,95
  Bottom 0.203: v156.46,95 v130.05,95 v103.63,95 v77.22,95 v58.93,95 v29.46,95 | v59.18,57.4 58.17,58.42 58.17,89.15 v58.93,89.92
AGND  (via drill 0.3, 0.6)
  Top 0.254: U15.4 120.94,44.92 120.9,44.96 v120.9,45.72 | C35.2 v124.97,42.67 | U13.4 143.57,36.77 v143.51,36.83 | C37.2 v148.34,35.56 | C36.2 v138.18,37.59 | U14.4 134.15,39.58 134.11,39.62 v134.11,40.39 | C27.2 135.94,29.48 R71.1 134.11,27.69 v132.08,27.69 | U18.6 128.06,43.73 127.76,43.43 127.76,42.93 | 127.76,42.93 v127.76,42.42 127.77,42.43 U18.8 | U18.7 128.42,43.08 128.27,42.93 127.76,42.93 | v131.83,49.4 C31.2 | U16.3 v146.3,52.58 | C32.2 143.22,45.68 143.26,45.72 v143.26,46.48 | U17.2 v107.7,28.45 | C23.1 101.38,29.25 v101.35,29.21 | R61.1 104.66,34.78 v104.65,34.8 | U22.8 154.26,37.42 154.43,37.34 v154.43,35.81 | U21.8 154.51,27.51 154.43,27.43 v154.43,26.67 | C34.2 162.34,42.71 v162.31,42.67 | C33.2 162.34,33.82 v162.31,33.78
  other vias: 123.95,6.1 131.06,8.13 131.06,6.1 124.97,5.08 129.03,5.08 120.9,5.08 130.05,7.11 119.89,6.1 122.94,5.08 130.05,9.14 121.92,6.1 128.02,6.1 127,5.08 125.98,6.1 48.77,42.67 46.74,42.67 50.8,42.67 49.78,47.75 71.12,58.67 49.78,74.17 55.88,74.17 41.66,58.93 41.66,87.38 43.69,87.38 39.62,87.38 82.3,84.33 84.33,84.33 86.36,84.33 88.39,84.33 107.7,84.33 109.73,84.33 111.76,84.33 105.66,84.33 132.08,84.33 134.11,84.33 136.14,84.33 138.18,84.33 160.53,85.34 158.5,85.34 162.56,85.34 164.59,85.34 52.83,42.67 54.86,42.67 56.9,47.75 51.82,44.7 49.78,44.7 41.66,62.99 33.53,87.38 35.56,87.38 37.59,87.38 33.53,83.31 35.56,83.31 37.59,83.31 39.62,83.31 41.66,83.31 43.69,83.31 82.3,76.2 84.33,76.2 86.36,76.2 88.39,76.2 106.68,72.14 108.71,72.14 110.74,72.14 112.78,72.14 132.08,72.14 134.11,72.14 136.14,72.14 138.18,72.14 148.34,71.12 148.34,69.09 148.34,67.06 148.34,65.02 148.34,62.99 50.8,57.91 59.94,61.98
  pour Top (isolate 0.254, rank 6): 75.18,40.64 75.18,4.06 195,4 195,96 0,96 0,46.74 12.19,46.74 12.19,40.64
  pour Bottom (isolate 0.254): 0,96 0,46.74 12.19,46.74 12.19,40.64 75.18,40.64 75.18,4 195,4 195,96
ALM_LOW_BAT  (via drill 0.3)
  Top 0.203: U28.69 46.78,57.96 46.74,57.91 45.72,57.91 v44.7,56.9 42.67,54.86 32,54.86 v30.73,53.59 | v19.3,44.7 18.54,43.94 17.78,43.94 17.53,43.69 17.53,42.9 U5.2
  Bottom 0.203: v30.73,53.59 30.73,47.5 28.96,45.72 20.32,45.72 v19.3,44.7
AMP_0  (via drill 0.3)
  Top 0.203: v60.45,63.75 61.98,63.75 62.18,63.96 U28.19 | U24.5 105.66,91.44 v105.66,93.47 | v60.45,93.47 v60.45,89.92 | U23.5 158.5,91.44 v158.5,93.47 | U26.5 132.08,91.44 v132.08,93.47 | U27.5 79.25,91.44 v79.25,93.47 | U25.5 31.5,91.44 v31.5,93.47 | v120.9,93.47 v120.9,85.85
  Top 0.254: U18.10 134.21,43.08 134.11,43.18 v133.6,43.18
  Bottom 0.203: v133.6,43.18 133.35,43.18 132.08,43.18 130.81,44.45 130.81,54.61 130.05,55.37 122.17,55.37 120.9,56.64 v120.9,85.85 | v158.5,93.47 v132.08,93.47 v120.9,93.47 v105.66,93.47 v79.25,93.47 v60.45,93.47 v31.5,93.47 | v60.45,89.92 v60.45,63.75
AMP_1  (via drill 0.3)
  Top 0.203: v61.21,64.52 61.72,64.52 61.78,64.46 U28.20 | U24.6 105.66,89.41 104.9,90.17 104.67,90.42 v104.67,94.23 | v62.48,94.23 v62.48,89.92 | 158.5,89.41 U23.6 159.51,90.42 v159.51,94.23 | U26.6 132.08,89.41 131.09,90.42 v131.09,94.23 | U27.6 79.25,89.41 78.26,90.42 v78.26,94.23 | U25.6 31.5,89.41 30.5,90.42 v30.5,94.23 | v119.89,94.23 v119.89,85.09
  Top 0.254: U18.9 134.12,42.43 134.11,42.42 v132.84,42.42
  Bottom 0.203: v132.84,42.42 132.08,42.42 130.3,44.2 130.3,54.36 129.79,54.86 120.9,54.86 119.89,55.88 v119.89,85.09 | v119.89,94.23 v104.67,94.23 v78.26,94.23 v62.48,94.23 v30.5,94.23 | v119.89,94.23 v131.09,94.23 v159.51,94.23 | v61.21,64.52 62.48,65.79 v62.48,89.92 | v119.89,94.23 125.48,94.23
BATT+  (via drill 0.9)
  Top 0.889: v141.22,11.18 136.48,11.18 L7.4 | v76.2,11.18 73.49,11.18 L1.4
  Route2 0.889: v141.22,11.18 143.26,13.21 175.01,13.21 176.02,12.19 176.02,7.96 | v76.2,11.18 101.6,11.18 109.73,3.05 174.75,3.05 176.02,4.32 176.02,7.96 | 176.02,7.96 SW1.1
BATT-  (via drill 0.9)
  Top 0.889: L7.3 138.43,8.89 v139.19,8.13 | v76.2,9.14 73.49,9.14 L1.3
  Route15 0.889: v76.2,9.14 100.58,9.14 106.68,3.05 149.35,3.05 151.38,5.08 CN6.4 CN6.3 151.38,8.13 v139.19,8.13
CH_0  (via drill 0.3)
  Top 0.203: U28.16 64.24,62.46 64.26,62.48 65.53,62.48 v67.06,64.01
  Top 0.254: U22.11 160.23,38.65 160.02,38.61 157.99,38.61 157.73,38.35 v157.73,29.97 157.99,29.72 159.26,29.72 159.47,29.5 U21.11
  Bottom 0.203: v67.06,64.01 67.82,64.77 68.83,64.77 69.6,64.01 69.6,61.72 68.33,60.45 68.33,51.31 69.6,50.04 79.76,50.04 81.79,48.01 81.79,24.89 82.3,24.38 156.46,24.38 157.73,25.65 v157.73,29.97
CH_1  (via drill 0.3)
  Top 0.203: U28.15 64.5,61.96 64.52,61.98 66.04,61.98 66.55,62.48 66.8,62.48 v68.33,64.01
  Top 0.254: U22.10 159.61,38 159.51,38.1 159,38.1 158.5,37.59 v158.5,30.99 | U21.10 159.61,28.86 159.51,28.96 v158.5,28.96
  Bottom 0.203: v68.33,64.01 69.09,63.25 69.09,62.23 67.82,60.96 67.82,51.05 69.34,49.53 79.5,49.53 81.28,47.75 81.28,24.64 82.04,23.88 156.72,23.88 158.5,25.65 v158.5,28.96
  Bottom 0.254: v158.5,28.96 v158.5,30.99
CH_2  (via drill 0.3)
  Top 0.203: U28.14 65.79,61.48 66.3,61.48 66.8,61.98 67.56,61.98 v68.33,62.74 | v160.53,27.43 160.53,28.13 U21.9
  Top 0.254: U22.9 159.52,37.35 159.51,37.34 v159.26,37.34 | U21.9 159.27,28.2 159.26,28.19 157.73,28.19 156.97,28.96 v156.97,37.34
  Bottom 0.203: v68.33,62.74 67.31,61.72 67.31,50.8 69.09,49.02 79.25,49.02 80.77,47.5 80.77,24.38 81.79,23.37 157.23,23.37 160.53,26.67 v160.53,27.43
  Bottom 0.254: v156.97,37.34 v159.26,37.34
COMP_80  (via drill 0.3)
  Top 0.203: U28.26 61.63,69.75 61.98,70.1 v64.01,70.1 | R58.2 109.71,33.51 v109.98,33.53
  Bottom 0.203: v109.98,33.53 102.62,33.53 101.35,34.8 84.58,34.8 83.31,36.07 83.31,48.77 80.52,51.56 70.36,51.56 69.85,52.07 69.85,58.93 71.37,60.45 71.37,65.28 70.61,66.04 65.02,66.04 64.01,67.06 v64.01,70.1
DGND  (via drill 0.6, 0.9)  (1 unrouted)
  Top 0.305: U30.3 258.44,56.26 258.57,56.39 | U33.10 238.89,92.08 238.76,91.95
  Top 0.889: L8.1 228.58,8.89 C67.NEG
  other vias: 230.63,8.13 232.66,8.13 231.65,7.11 230.63,6.1 232.66,6.1 229.62,7.11 227.58,7.11 225.55,7.11 226.57,6.1 228.6,6.1 224.54,6.1 223.52,7.11 231.14,20.32 231.14,22.86 231.14,25.4
  pour Top (isolate 0.254): 0,4 69.09,4 69.09,38.61 10.16,38.61 10.16,44.7 0,44.7
  pour Bottom (isolate 0.254): 0,4 69.09,4 69.09,38.61 10.16,38.61 10.16,44.7 0,44.7
  pour Top (isolate 0.254): 198,4 313,4 313,96 198,96
  pour Bottom (isolate 0.254): 198,4 313,4 313,54 261,54 261,60 236,60 236,9 220,9 220,66 198,66
DIN00  (via drill 0.3)
  Top 0.203: R2.2 14.21,31 v14.22,30.99 | v26.42,10.16 26.42,9.65 26.92,9.14 27.69,9.14 27.73,9.19 U2.1
  Top 0.305: U1.4 14.86,34.92 14.22,34.54 14.22,34.56 R2.2
  Bottom 0.203: v14.22,30.99 24.89,30.99 26.42,29.46 v26.42,10.16
DIN07
  Top 0.305: U5.4 18.92,34.92 19.3,34.54 19.3,33.54 R9.2
FLAME_SYNC  (via drill 0.3)
  Top 0.203: U28.75 46.83,54.96 44.7,52.83 v29.97,52.83 | v13.97,45.97 13.46,45.47 13.46,42.9 U1.2
  Bottom 0.203: v29.97,52.83 29.97,47.75 28.7,46.48 14.48,46.48 v13.97,45.97
N$1
  Top 0.254: R1.2 25.15,19.3 28.19,22.35 28.98,22.35 U4.17
N$2
  Top 0.254: R6.2 24.64,23.37 24.64,23.62 25.91,23.62 27.18,24.89 28.98,24.89 U4.15
N$3
  Top 0.254: R7.2 26.42,25.4 27.18,26.16 28.7,26.16 28.7,26.42 28.98,26.42 U4.14
N$4
  Top 0.254: R8.2 28.98,27.43 U4.13
N$5
  Top 0.254: R11.2 27.18,29.46 27.94,28.7 28.98,28.7 U4.12
N$6
  Top 0.254: R12.2 26.67,31.5 28.19,29.97 28.98,29.97 U4.11
N$7
  Top 0.254: R4.2 25.4,21.34 27.69,23.62 28.98,23.62 U4.16
N$9
  Top 0.254: U10.3 43.75,8.18 R21.1 42.42,8.13 42.16,8.38 42.16,9.91 41.93,10.14 R22.1 R24.2
N$10
  Top 0.254: R21.2 45.65,8.18
  Top 0.305: U10.4 45.72,10.46 45.72,9.4 | 45.72,9.4 45.72,8.14 R21.2 | TP2.1 47.75,8.87 R23.1 47.75,10.16 46.99,9.4 45.72,9.4
N$11
  Top 0.305: R51.1 112.27,32 111.76,32.51 R50.2
N$12
  Top 0.254: U10.1 42.53,11.83 42.16,12.19 R26.1 40.42,12.39 C5.2
N$13
  Top 0.305: R40.3 118.36,49.78 117.86,49.8 R39.2
N$14
  Top 0.203: U9.4 59.94,25.15 61.21,23.88 U9.10 | 56.13,16.76 56.13,14.39 TR1.C | 54.1,20.32 54.1,17.27 54.61,16.76 56.13,16.76 | 56.13,16.76 D1.A
  Top 0.305: U9.4 54.61,25.15 54.1,24.64 54.1,20.32 R25.2
N$15
  Top 0.203: U9.13 67.55,27.69 R19.1
N$16
  Top 0.254: 19.27,23.62 C1.2
  Top 0.61: U3.2 17.85,23.81 18.03,23.62 19.05,23.62 | 19.05,23.62 19.27,23.62 22.35,23.62 R11.1 | R11.1 R12.1 | R11.1 R8.1 R7.1 R6.1 R4.1 R1.1 | 19.05,23.62 C1.2 19.34,23.58
N$17
  Top 0.305: CN5.1 190.67,29 188.09,26.42 188.09,23.5 186.94,22.35 179.83,22.35 179.44,22.35 R64.2
N$18
  Top 0.61: U3.1 18.62,21.27 R5.1
N$19  (via drill 0.3)
  Top 0.254: v132.84,43.94 133.86,43.94 134.15,43.73 U18.11 | 137.18,49.8 R30.2 v135.64,51.82
  Top 0.305: R31.1 137.18,49.8 137.16,50.04
  Bottom 0.305: v132.84,43.94 132.84,49.78 134.87,51.82 v135.64,51.82
N$20
  Top 0.203: U6.1 22.93,11.11 23.55,10.48 U2.6
  Top 0.254: U6.1 12.19,11.11 11.37,11.94 11.37,18.03 12.13,18.8 13.43,18.8 U6.4
N$21
  Top 0.254: U18.15 135.75,46.33 | R32.1 139.18,49.75
  Top 0.305: 135.75,46.33 R32.1 | 139.18,49.75 R31.2
N$22
  Top 0.254: U18.14 136.95,45.68 137.16,45.72 R33.1 138.92,47.47
  Top 0.305: 138.92,47.47 R32.2
N$23
  Top 0.203: U1.1 14.88,42.77 14.99,42.67 14.99,44.12 R3.1
N$24
  Top 0.203: U5.1 18.9,42.77 18.8,42.67 20.07,42.67 20.57,41.91 21.66,41.91 R10.1
N$25
  Top 0.254: U18.12 136.49,44.38 R34.1 138.19,44.74 R33.2
N$26
  Top 0.203: 130.05,34.53 130.05,32.77 131.32,31.5 134.62,31.5
  Top 0.254: 130.05,34.53 R68.1 | U14.5 134.15,31.52 R71.2 | R71.2 134.1,31.5 | C27.1 135.34,31.28 135.13,31.5 134.62,31.5 134.13,31.5 R71.2
N$27
  Top 0.254: U13.6 144.96,31.43 144.27,30.73 144.27,29.48 | 144.27,29.48 R53.2 | 144.27,29.48 R54.1 144.29,29.23 144.27,29.21 144.27,27.5 C19.2
N$28
  Top 0.254: U18.13 134.18,45.03 134.11,44.96 132.33,44.96 132.08,44.7 132.08,41.4 132.33,41.15 135.13,41.15 135.38,40.89 135.38,39.62 135.45,39.55 U14.2
N$29
  Top 0.254: R34.2 138.16,42.66 136.1,40.6 U14.1
  Top 0.305: U14.1 136.1,38.65 136.14,38.61 139.19,38.61 139.45,38.35 139.45,34.29 138.68,33.53 138.68,33.02 139.19,32.51 139.19,30.23 139.7,29.72 140.17,29.72 C13.2
N$30
  Top 0.305: 132.08,37.59 R46.2 | R43.2 131.57,37.59 132.08,37.59 | U14.3 134.8,38.03 134.37,37.59 132.08,37.59
N$31  (via drill 0.3)
  Top 0.203: U16.10 147.29,47.78 v147.07,48.01
  Top 0.254: R54.2 146.29,29.23 146.3,29.21 146.3,27.5 C19.1 | U13.7 145.61,31.43 146.3,30.73 146.3,29.48 R54.2 | R54.2 TP6.1
  Bottom 0.254: v147.07,48.01 147.07,40.89 148.34,39.62 150.37,39.62 151.38,38.61 151.38,34.54 149.35,32.51 TP6.1
N$32  (via drill 0.3)
  Top 0.203: U16.6 145.31,47.73 145.03,48.01 v144.02,48.01
  Top 0.254: R36.2 146.26,38.58 U13.1 146.26,36.79 146.3,36.83 148.08,36.83 148.34,36.58 TP4.1
  Bottom 0.254: 148.59,36.58 146.3,36.58 144.02,38.86 v144.02,48.01
  Bottom 0.305: TP4.1 148.59,36.58
N$33
  Top 0.254: U13.2 145.61,38.03 145.29,38.35 145.29,39.62 R36.1 145.29,40.62 R35.2
N$34
  Top 0.254: U13.3 144.96,37.66 144.02,38.61 143.26,38.61 | 143.26,38.61 R38.2 | 143.26,38.61 R45.2 142.22,39.62 141.22,39.62 C16.1
N$35
  Top 0.203: R57.1 149.35,50.8 148.34,51.82 147.07,51.82 146.81,51.56 U16.2
N$36
  Top 0.203: U16.9 146.81,45.72 147.07,45.47 148.34,45.47 149.61,46.74 R55.1
N$37  (via drill 0.3)
  Top 0.254: v153.92,50.8 R57.2 | v153.92,46.74 R55.2 | U21.3 152.95,31.45 v152.91,31.5
  Bottom 0.254: v153.92,50.8 v153.92,46.74 152.91,45.72 v152.91,31.5
N$38
  Top 0.203: U16.7 145.8,48.51 146.05,48.77 R37.1
  Top 0.254: R37.1 150.37,48.78
N$39
  Top 0.203: U16.4 145.8,51.56 145.54,51.82 145.54,52.83 146.05,53.34 148.84,53.34 149.35,52.83 R44.1
N$40
  Top 0.254: R44.2 155.19,52.83 155.7,52.32 155.7,48.77 | 155.7,48.77 R37.2 | 155.7,48.77 155.7,40.89 155.41,40.6 U22.3
N$41
  Top 0.254: R40.1 125.97,50.8 R41.1
N$42  (via drill 0.3)
  Top 0.305: R41.2 124.97,47.75 122.89,45.68 U15.1 122.89,44.16 122.94,44.2 v124.21,44.2 123.71,44.2 | v118.62,44.2 C18.1 | v119.89,31.75 R42.1
  Bottom 0.305: v124.21,44.2 v118.62,44.2 118.62,32.51 v119.89,31.75
N$43
  Top 0.305: U15.6 121.59,37.77 120.9,37.08 120.4,37.08 119.89,36.58 R42.2 120.89,34.54 121.92,34.54 122.43,34.04 C14.2
N$44  (via drill 0.3)
  Top 0.305: U15.7 122.25,38.54 122.43,38.35 C14.1 124.37,36.14 R52.2 124.97,36.83 125.73,37.59 TP7.1 R43.1 | U17.1 106.68,27.69 v106.68,26.42
  Bottom 0.305: v106.68,26.42 124.97,26.42 125.73,27.43 125.73,36.58 TP7.1
N$45
  Top 0.305: U15.2 122.25,45.4 121.92,45.72 R40.2
N$46  (1 unrouted)
  Top 0.305: U15.3 121.59,42.85 121.16,42.42 119.13,42.42 118.62,41.91 118.62,40.39 117.86,39.62 R48.1 | C21.1 117.42,37.52 116.84,38.1 116.84,39.61
N$47
  Top 0.305: R49.1 116.82,41.62 R48.2
N$48
  Top 0.305: C18.2 114.3,44.12 114.3,42.42 114.82,41.89 R49.2 112.79,41.66 R50.1
N$49
  Top 0.305: R52.1 124.97,30.99 124.46,30.48 122,30.48 D3.3 121.75,30.56 121.67,30.48 R51.3 R51.2
N$50
  Top 0.203: U28.23 65.45,65.96 68.07,68.58 R75.1
  Top 0.305: R75.1 67.82,69.09 CN7.9
N$51
  Top 0.254: C13.1 141.01,31.28 141.22,31.5 142.22,31.5 R53.1 142.24,33.53 | 142.24,33.53 R38.1 | 142.24,33.53 TP5.1
N$52
  Top 0.254: U14.6 134.8,33.34 135.13,33.02 135.38,33.02 | U14.7 135.45,33.6 135.38,33.53 135.38,33.02 | R69.1 138.18,32.51 137.67,33.02 135.38,33.02
N$53
  Top 0.203: U28.12 64.76,60.46 65.28,59.94 TP12.P$1
N$54  (via drill 0.3)
  Top 0.254: U9.3 60.71,26.42 61.98,25.15 U9.11
  Top 0.305: v43.43,25.15 41.91,25.15 41.78,25.27 U11.4 | v54.36,26.42 U9.3
  Bottom 0.305: v43.43,25.15 52.83,25.15 v54.36,26.42
N$55
  Top 0.305: R102.2 299.72,79.54 C64.1 298.16,77.72 280.42,77.72 279.91,77.22 U38.13
N$56
  Top 0.203: U28.24 64.94,66.46 66.29,67.82 66.29,77.98 66.8,78.49 68.83,78.49 69.09,78.74 69.09,81.03 CN7.1 64.02,82.3 R77.2
N$57
  Top 0.254: R58.1 106.68,31.51 R59.1 | U17.3 106.61,29.14 106.68,29.21 106.68,31.48 R59.1 | R59.1 R61.2
N$58
  Top 0.254: U17.4 104.71,29.14 104.65,29.21 104.65,31.48 R59.2 102.63,31.5 R62.1
N$59
  Top 0.406: R72.2 190.6,19.3 D4.C
N$60
  Top 0.254: U19.4 130.73,18.75 C26.1
N$61
  Top 0.254: U33.17 231.01,84.45 229.62,83.06 229.62,81.28 228.6,80.26 R86.2
N$62
  Top 0.254: C25.1 R70.2 R67.1 129.03,19.3 129.54,18.8 129.54,16.51 129.79,16.26 U19.5
N$63
  Top 0.254: U33.15 231.27,87 228.6,84.33 R90.2
N$64
  Top 0.305: U20.4 117.52,17.61 116.84,18.29 C38.1
N$65
  Top 0.254: U33.14 230.5,88.27 228.6,86.36 R91.2
N$66
  Top 0.254: U33.13 230.76,89.53 229.62,88.39 R93.2
N$67
  Top 0.254: U33.12 230,90.81 229.62,90.42 R94.2
N$68
  Top 0.254: U33.16 231,85.72 R88.2
N$69
  Top 0.254: U33.18 231.01,83.19 230.63,82.8 230.63,80.01 227.33,76.71
  Top 0.305: 227.33,76.71 226.82,76.2 TP18.1
N$70
  Top 0.305: R94.1 R95.1
  Top 0.406: R94.1 R93.1 R91.1 R90.1 R88.1 R86.1
  Top 0.61: R90.1 220.73,84.33 220.47,84.58 218.48,84.58 C60.2 214.78,84.54 214.06,83.82 U31.2
N$71
  Top 0.203: U28.25 64.42,66.96 65.28,67.82 65.28,77.22 | 65.28,77.22 65.28,79.16 65.87,79.76 CN7.3 | R74.1 64.75,77.2 65.28,77.22
N$72
  Top 0.203: U28.22 65.86,65.46 66.04,65.53 66.8,66.29 71.88,66.29 73.15,67.56 73.15,75.95 | 73.15,75.95 69.09,75.95 CN7.5 | R76.1 73.39,75.93 73.15,75.95
N$73
  Top 0.305: R106.2 293.62,79.29 C66.1 277.88,79.25 277.37,78.74 U38.11
N$74
  Bottom 0.889: CN6.2 CN6.1 155.45,11.18 F2.1
N$75
  Top 0.203: C58.1 70.1,50.8 69.85,51.05 69.1,51.05 U29.4
N$76
  Top 0.254: R66.1 R67.2
N$77
  Top 0.305: SW6.1 294.02,87.77 293.62,87.38 R106.1 R104.1
N$78
  Top 0.203: U28.56 46.79,64.46 46.74,64.52 45.47,64.52 42.16,67.82 TP16.P$1
N$79
  Top 0.203: U28.57 47.04,63.96 46.99,64.01 44.7,64.01 42.67,66.04 TP15.P$1
N$80
  Top 0.203: U28.58 43.9,63.46 42.93,64.26 TP14.P$1
N$81
  Top 0.203: U28.61 46.22,61.96 45.22,60.96 40.92,60.96 TP13.P$1
N$82
  Top 0.61: CN1.2 185.68,93.98 180.47,93.98 180.04,93.56 L2.1
N$83
  Top 0.61: L2.2 174.5,91.69 175.77,90.42 179.83,90.42 180.97,89.28 180.97,85.22 182.12,84.07 185.63,84.07 CN1.3
N$84
  Top 0.61: L3.1 177.04,78.23 178.94,76.33 180.97,76.33 183.64,78.99 CN2.2
N$85
  Top 0.61: L3.2 174.5,76.45 177.55,73.41 180.97,73.41 181.86,72.52 181.86,70.1 182.88,69.09 185.61,69.09 CN2.3
N$86
  Top 0.61: L4.1 177.21,63.08 178.44,61.85 181.23,61.85 183.39,64.01 CN3.2
N$87
  Top 0.61: L4.2 174.5,60.2 176.28,58.42 181.23,58.42 182.25,57.4 182.25,54.99 183.26,53.98 185.68,53.98 CN3.3
N$88
  Top 0.61: L5.1 177.08,47.84 178.31,46.61 181.23,46.61 183.51,48.9 185.59,48.9 CN4.2
N$89
  Top 0.61: L5.2 174.5,45.97 177.04,43.43 181.23,43.43 183.26,41.4 183.26,39.88 184.02,39.12 185.58,39.12 CN4.3
N$90
  Top 0.61: L6.1 177.21,33.61 179.32,31.5 181.23,31.5 183.64,33.91 185.61,33.91 CN5.2
N$91
  Top 0.61: L6.2 174.5,31.75 177.8,28.45 181.36,28.45 182.5,27.3 182.5,25.02 183.51,24 CN5.3
N$92
  Top 0.305: SW6.3 299.1,87.74 299.72,87.12 R102.1 R101.1
N$93
  Top 0.305: CN4.1 190.56,44 188.09,41.53 188.09,37.72 186.94,36.58 180.23,36.58 R63.2
N$94
  Top 0.305: SW6.2 296.56,85.46 296.67,85.34 R105.2
N$95
  Top 0.254: 302.51,69.85 302.26,69.6 300.38,69.6 U37.4
  Top 0.305: 302.51,69.85 D7.C
N$96
  Top 0.203: TP17.P$1 60.2,76.71 60.45,76.45 60.45,70.1 60.13,69.67 U28.29
N$97
  Top 0.61: U31.1 216.4,81.27 R89.1
N$98  (via drill 0.3)
  Top 0.305: U37.2 301.88,66.93 302.01,67.06 v306.58,67.06 306.58,69.09 D8.C | 281.2,83.06 U38.1 281.18,80.26 | 281.18,80.26 275.59,80.26 274.83,79.5 244.09,79.5 241.55,76.96 241.55,72.14 240.54,71.12 U34.1 | 281.18,80.26 v283.46,80.26
  Top 0.61: U34.4 209.98,78.73 208.98,77.72 208.98,72.14 209.99,71.12 U34.1
  Bottom 0.305: v283.46,80.26 306.07,80.26 306.58,79.76 v306.58,67.06
N$99
  Top 0.203: U2.3 29.62,10.51 29.72,10.41 R27.1 | D2.A 30.5,11.66 30.73,11.43 30.73,10.43 R27.1 | C6.1 30.95,8.42 30.73,8.64 30.73,10.4 R27.1
N$100
  Top 0.305: CN9.1 203.41,16.3 203.45,16.26 F1.1
N$101
  Top 0.305: U7.1 28.83,34.92 28.45,34.54 R13.2
N$102  (via drill 0.9)
  other vias: 238.76,50.8
N$103  (via drill 0.9)
  other vias: 238.76,48.26
N$104
  Top 0.305: U8.1 32.89,34.92 33.53,34.54 R15.2
N$105  (via drill 0.9)
  other vias: 238.76,45.72
N$106  (via drill 0.9)
  other vias: 238.76,43.18
N$107  (via drill 0.9)
  other vias: 238.76,40.64
N$108  (via drill 0.9)
  other vias: 238.76,38.1
N$109  (via drill 0.9)
  other vias: 238.76,35.56
N$110  (via drill 0.9)
  other vias: 238.76,33.02
N$111  (via drill 0.9)
  other vias: 238.76,30.48
N$112  (via drill 0.9)
  other vias: 238.76,27.94
N$113  (via drill 0.9)
  other vias: 238.76,25.4
N$114  (via drill 0.9)
  other vias: 238.76,22.86
N$115  (via drill 0.9)
  other vias: 238.76,20.32
N$116  (via drill 0.9)
  other vias: 241.3,50.8
N$117  (via drill 0.9)
  other vias: 241.3,48.26
N$118  (via drill 0.9)
  other vias: 241.3,45.72
N$119  (via drill 0.9)
  other vias: 241.3,43.18
N$120  (via drill 0.9)
  other vias: 241.3,40.64
N$121  (5 unrouted)
  Top 0.305: CN9.5 202.12,12.03 CN9.C5
  Top 0.61: CN9.C5 205.27,11.9 208.28,8.89 L8.4
N$122
  Top 0.305: 213.11,10.92 213.36,10.67 213.36,11.34 L8.3
  Top 0.61: F1.2 212.85,14.73 213.11,14.48 213.11,10.92
N$123
  Top 0.305: R97.2 289.54,66.09 C62.2 289.75,66.29 290.83,66.29 291.59,67.06 292.61,67.06 292.74,66.93 U37.15
N$124
  Top 0.305: CN8.1 244.84,60.96 246.63,60.96 247.14,60.45 247.14,58.17 247.78,57.53 U30.1
N$125  (via drill 0.3)
  Top 0.305: U9.1 57.4,28.98 57.4,29.72 56.88,30.24 R18.1 v56.9,30.23
N$126
  Top 0.305: U11.15 50.42,27.81 50.8,27.43 51.8,27.43 R20.2 C4.2
N$127  (via drill 0.9)
  other vias: 241.3,38.1
N$128
  Top 0.203: D1.C 59.69,16.76 59.71,16.74 59.71,15.47 60.2,14.99 61.11,14.99 U12.4
N$129
  Top 0.203: U2.5 25.36,11.13 25.65,11.43 25.65,13.46 26.42,14.22 36.58,14.22 38.61,16.26 48.77,16.26 49.53,15.49 R28.1
N$130
  Top 0.203: R28.2 R29.2 52.88,15.17 TR1.B
N$131
  Top 0.305: CN3.1 187.96,56.26 187.96,52.83 187.07,51.94 182.75,51.94 182.25,52.45 180.45,52.45 R60.2
N$132
  Top 0.305: CN2.1 190.59,74 188.09,71.5 188.09,68.07 187.07,67.06 180.36,67.06 R56.2
N$133
  Top 0.305: CN1.1 187.96,86.26 187.96,82.42 186.82,81.28 180.58,81.28 R47.2
N$134
  Top 0.305: U35.1 259.46,66.42 259.84,66.04 R96.1
N$135  (via drill 0.9)
  other vias: 241.3,35.56
N$136  (via drill 0.9)
  other vias: 241.3,33.02
N$137  (via drill 0.9)
  other vias: 241.3,30.48
N$138  (via drill 0.9)
  other vias: 241.3,27.94
N$139  (via drill 0.9)
  other vias: 241.3,25.4
N$140  (via drill 0.9)
  other vias: 241.3,22.86
N$141  (via drill 0.9)
  other vias: 241.3,20.32
N$142  (via drill 0.9)
  other vias: 243.84,50.8
N$143
  Top 0.305: CN8.2 245.86,57.17 246.89,56.13 251.74,56.13 U30.2
N$144  (via drill 0.9)
  other vias: 243.84,48.26
N$145  (via drill 0.9)
  other vias: 243.84,45.72
N$146
  Top 0.305: CN8.3 243.86,61.99 244.86,62.99 248.41,62.99 248.67,62.74 251.74,62.74 U32.1
N$147
  Top 0.305: U32.2 248.79,61.34 248.16,61.98 CN8.4
N$148  (via drill 0.3)
  Top 0.305: U35.4 251.59,66.42 251.46,66.29 v248.16,66.29
  Bottom 0.305: v248.16,66.29 246.17,66.29 CN8.5
N$149
  Top 0.305: U35.3 247.27,67.69 245.87,66.29 245.87,63.99 CN8.6
N$150
  Top 0.305: R98.1 304.8,73.15 305.38,73.73 D5.A
N$151
  Top 0.305: 304.8,76.2 D7.A 308.36,76.2 308.43,76.27 D5.C 308.67,76.2 310.13,76.2 310.64,75.69 310.64,69.6 310.13,69.09 D8.A
N$152
  Top 0.254: U36.7 255.02,83.21 255.02,85.09 254.22,85.89 C65.2 R103.2
N$153  (via drill 0.9)
  other vias: 243.84,43.18
N$154
  Top 0.305: U36.4 258.7,83.44 258.57,83.57 D6.C
N$155
  Top 0.305: U36.12 257.43,74.8 257.56,74.68 257.56,73.91 257.3,73.41 D9.C 257.3,72.39
N$156  (via drill 0.3)
  Top 0.305: v259.84,70.61 D9.A | U38.5 R100.1 276.08,85.6 273.56,85.6 271.53,87.63 260.35,87.63 259.61,88.37 D6.A 258.57,88.39 v257.3,88.39
  Bottom 0.305: v259.84,70.61 259.84,75.95 257.3,78.49 v257.3,88.39
N$157  (via drill 0.9)
  other vias: 243.84,40.64
N$158  (via drill 0.9)
  other vias: 243.84,38.1
N$159  (via drill 0.9)
  other vias: 243.84,35.56
N$160  (via drill 0.9)
  other vias: 243.84,33.02
N$161  (via drill 0.9)
  other vias: 243.84,30.48
N$162  (via drill 0.9)
  other vias: 243.84,27.94
N$163
  Top 0.305: U36.15 261.24,74.8 261.37,74.68 261.37,73.93 R99.2 263.16,70.3 C63.2
N$164  (via drill 0.9)
  other vias: 243.84,25.4
N$165  (via drill 0.9)
  other vias: 243.84,22.86
N$166  (via drill 0.9)
  other vias: 243.84,20.32
N$167  (via drill 0.9)
  other vias: 246.38,50.8
N$168  (via drill 0.9)
  other vias: 246.38,48.26
N$169  (via drill 0.9)
  other vias: 246.38,45.72
N$170  (via drill 0.9)
  other vias: 246.38,43.18
N$171  (via drill 0.9)
  other vias: 246.38,40.64
N$172  (via drill 0.9)
  other vias: 246.38,38.1
N$173  (via drill 0.9)
  other vias: 246.38,35.56
N$174  (via drill 0.9)
  other vias: 246.38,33.02
N$175  (via drill 0.9)
  other vias: 246.38,30.48
N$176  (via drill 0.9)
  other vias: 246.38,27.94
N$177  (via drill 0.9)
  other vias: 246.38,25.4
N$178  (via drill 0.9)
  other vias: 246.38,22.86
N$179  (via drill 0.9)
  other vias: 246.38,20.32
N$180  (via drill 0.9)
  other vias: 248.92,50.8
N$181  (via drill 0.9)
  other vias: 248.92,48.26
N$182  (via drill 0.9)
  other vias: 248.92,45.72
N$183  (via drill 0.9)
  other vias: 248.92,43.18
N$184  (via drill 0.9)
  other vias: 248.92,40.64
N$185  (via drill 0.9)
  other vias: 248.92,38.1
N$186
  Top 0.254: U33.11 230,92.08 229.62,92.46 R95.2
N$187  (via drill 0.9)
  other vias: 248.92,35.56
N$188  (via drill 0.9)
  other vias: 248.92,33.02
N$189  (via drill 0.9)
  other vias: 248.92,30.48
N$190  (via drill 0.9)
  other vias: 248.92,27.94
N$191  (via drill 0.9)
  other vias: 248.92,25.4
N$192  (via drill 0.9)
  other vias: 248.92,22.86
N$193  (via drill 0.9)
  other vias: 248.92,20.32
N$194  (via drill 0.9)
  other vias: 251.46,50.8
N$195  (via drill 0.9)
  other vias: 251.46,48.26
N$196  (via drill 0.9)
  other vias: 251.46,45.72
N$197  (via drill 0.9)
  other vias: 251.46,43.18
N$198  (via drill 0.9)
  other vias: 251.46,40.64
N$199